# Altium schematic sheet 精简版V5_2021-10-22.schdoc
size 430 x 384 mm
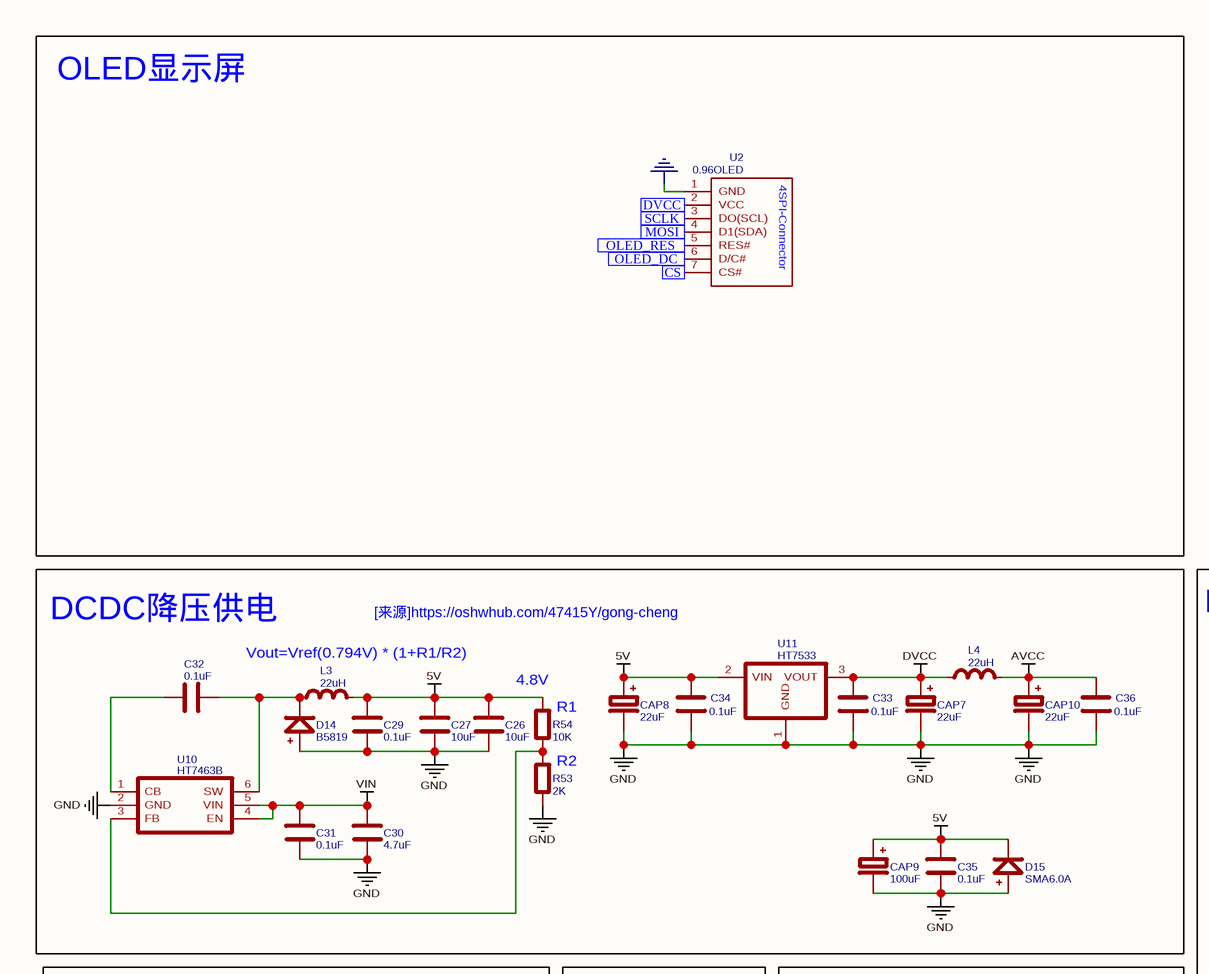
[diagram p0: 精简版V5_2021-10-22.schdoc, top left]
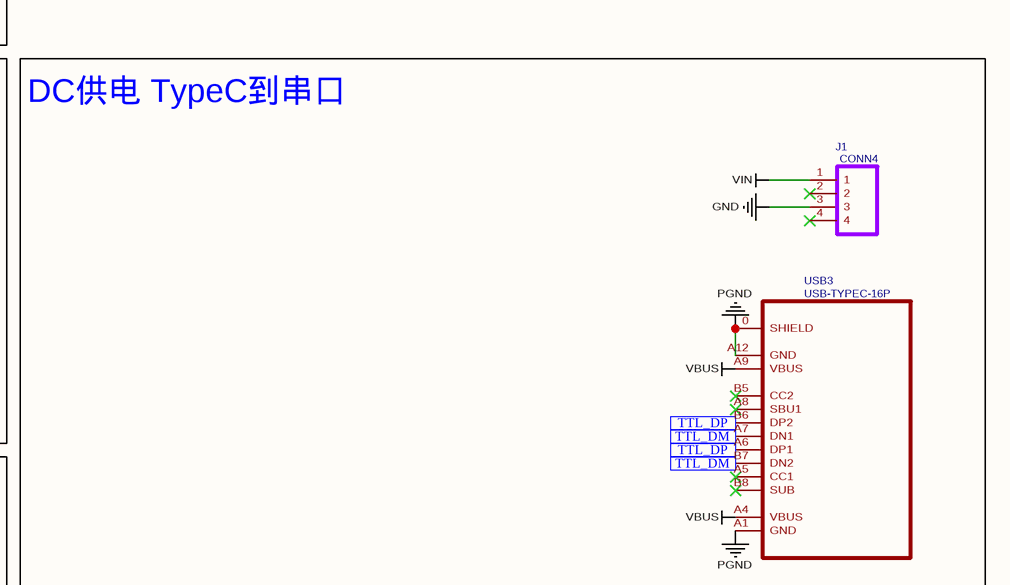
[diagram p1: 精简版V5_2021-10-22.schdoc, top right]
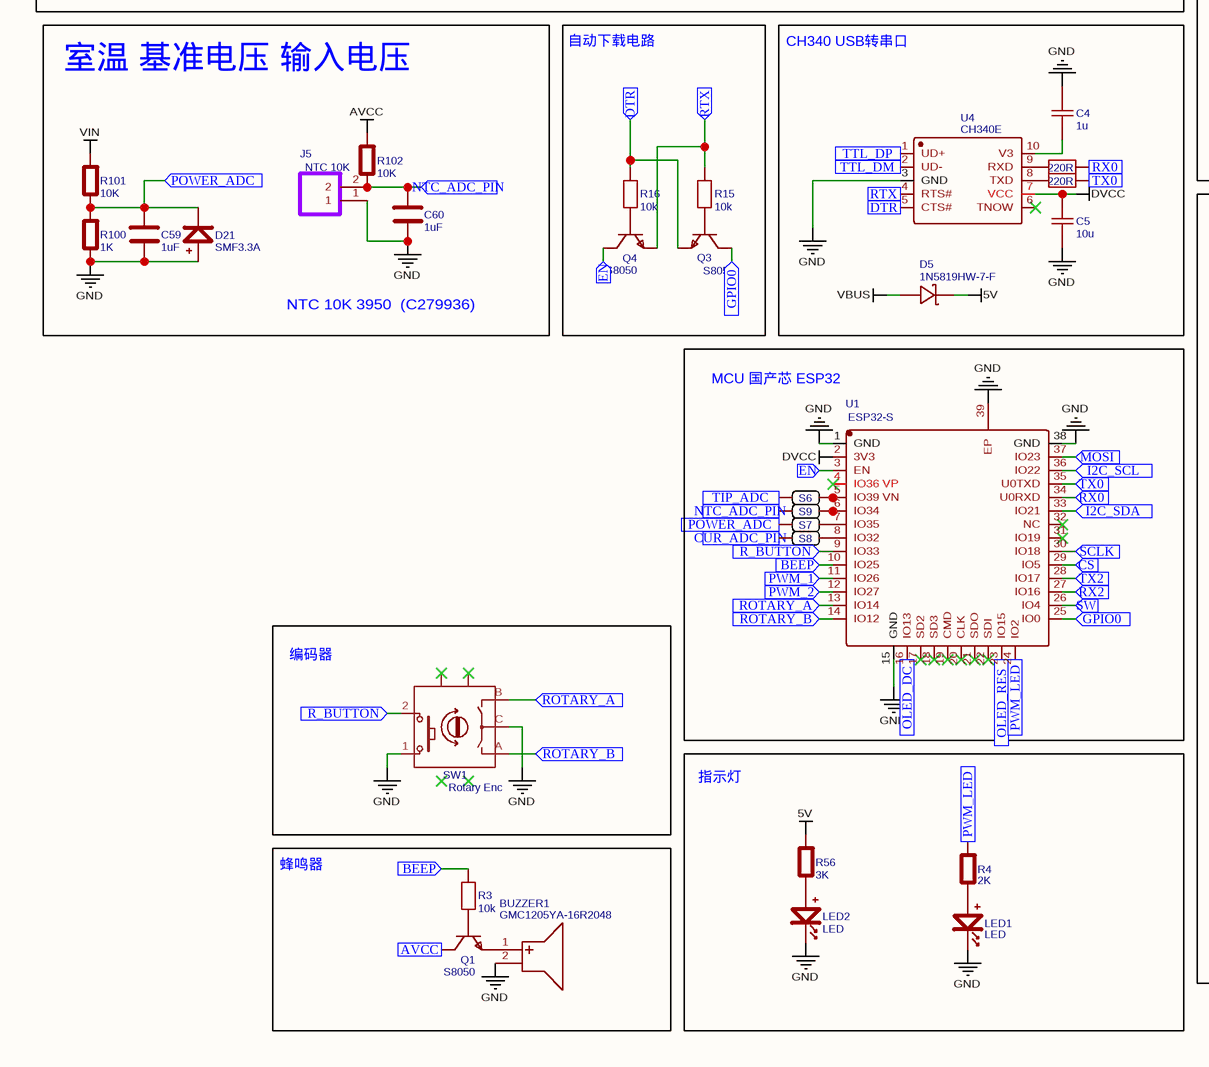
[diagram p2: 精简版V5_2021-10-22.schdoc, bottom left]
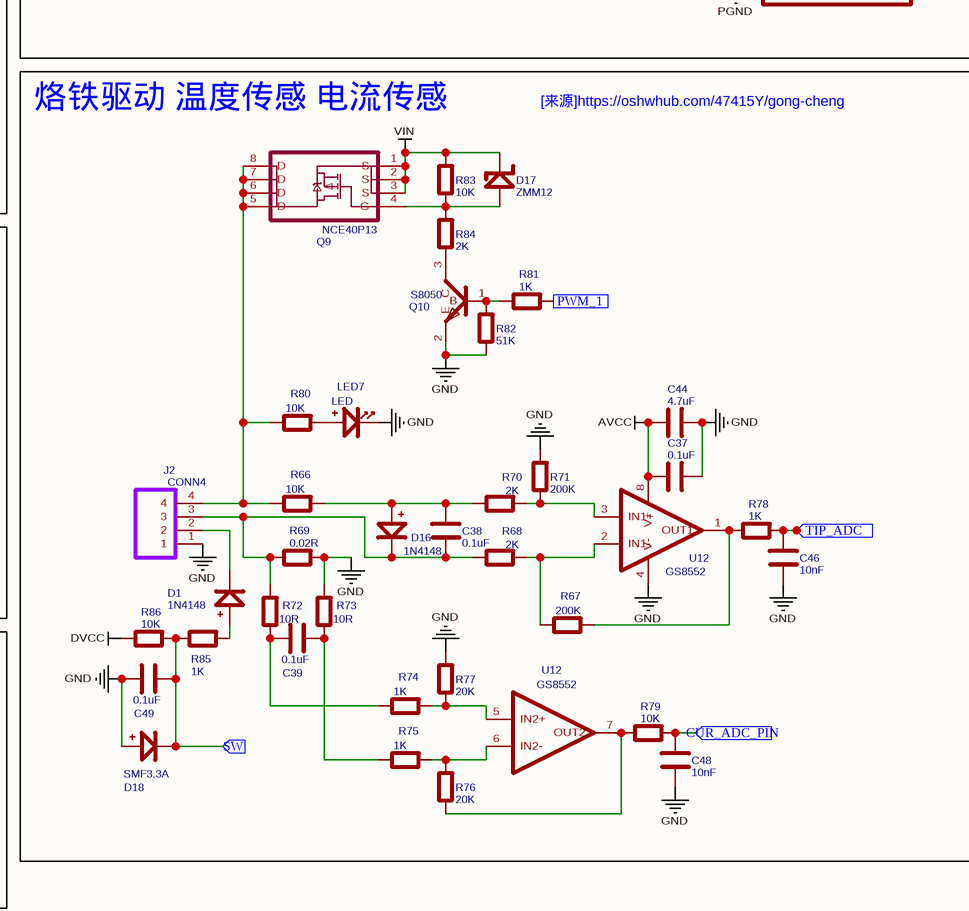
[diagram p3: 精简版V5_2021-10-22.schdoc, bottom right]

## Parts
(Parts that share a designator on the sheet are numbered #1, #2 ... from top to bottom, then left to right.)
BUZZER1  GMC1205YA-16R2048  [BUZ-TH_BD12.0-P6.50-D0.6-FD]
C4  1u  [C0603]
C5  10u  [C0603]
C26  10uF  [LC-0603-C]
C27  10uF  [LC-0603-C]
C29  0.1uF  [LC-0603-C]
C30  4.7uF  [LC-0603-C]
C31  0.1uF  [LC-0603-C]
C32  0.1uF  [LC-0603-C]
C33  0.1uF  [LC-0603-C]
C34  0.1uF  [LC-0603-C]
C35  0.1uF  [LC-0603-C]
C36  0.1uF  [LC-0603-C]
C37  0.1uF  [LC-0603-C]
C38  0.1uF  [LC-0603-C]
C39  0.1uF  [LC-0603-C]
C44  4.7uF  [LC-0603-C]
C46  10nF  [LC-0603-C]
C48  10nF  [LC-0603-C]
C49  0.1uF  [LC-0603-C]
C59  1uF  [LC-0603-C]
C60  1uF  [LC-0603-C]
CAP7  22uF  [CAPX-5.0]
CAP8  22uF  [CAPX-5.0]
CAP9  100uF  [CAPX-5.0]
CAP10  22uF  [CAPX-5.0]
D1  1N4148  [LC-SOD-123]
D5  1N5819HW-7-F  [SOD-123_L2.8-W1.8-LS3.7-FD]
D14  B5819  [LC-SOD-123]
D15  SMA6.0A  [LC-SOD-123]
D16  1N4148  [LC-SOD-123]
D17  ZMM12  [LC-SOD-123]
D18  SMF3.3A  [LC-SOD-123]
D21  SMF3.3A  [LC-SOD-123]
J1  CONN4  [SIP-4]
J2  CONN4  [SIP-4]
J5  NTC 10K  [SIP-2]
L3  22uH  [LIN0520]
L4  22uH  [LIN0520]
LED1  LED  [LC-0603-LED]
LED2  LED  [LC-0603-LED]
LED7  LED  [LC-0603-LED]
Q1  S8050  [SOT-23-3_L2.9-W1.3-P1.90-LS2.4-BR]
Q3  S8050  [SOT-23-3_L2.9-W1.3-P1.90-LS2.4-BR]
Q4  S8050  [SOT-23-3_L2.9-W1.3-P1.90-LS2.4-BR]
Q9  NCE40P13  [DFN8-5*6]
Q10  S8050  [LC-SOT-23(SOT-23-3)]
R3  10k  [R0603]
R4  2K  [LC-0603-R]
R15  10k  [R0603]
R16  10k  [R0603]
R18  220R  [R0603]
R19  220R  [R0603]
R53  2K  [LC-0603-R]
R54  10K  [LC-0603-R]
R56  3K  [LC-0603-R]
R66  10K  [LC-0603-R]
R67  200K  [LC-0603-R]
R68  2K  [LC-0603-R]
R69  0.02R  [LC-0603-R]
R70  2K  [LC-0603-R]
R71  200K  [LC-0603-R]
R72  10R  [LC-0603-R]
R73  10R  [LC-0603-R]
R74  1K  [LC-0603-R]
R75  1K  [LC-0603-R]
R76  20K  [LC-0603-R]
R77  20K  [LC-0603-R]
R78  1K  [LC-0603-R]
R79  10K  [LC-0603-R]
R80  10K  [LC-0603-R]
R81  1K  [LC-0603-R]
R82  51K  [LC-0603-R]
R83  10K  [LC-0603-R]
R84  2K  [LC-0603-R]
R85  1K  [LC-0603-R]
R86  10K  [LC-0603-R]
R100  1K  [LC-0603-R]
R101  10K  [LC-0603-R]
R102  10K  [LC-0603-R]
S6  Solder  [SW_HAND_WELD_JX]  (value not drawn)
S7  Solder  [SW_HAND_WELD_JX]  (value not drawn)
S8  Solder  [SW_HAND_WELD_JX]  (value not drawn)
S9  Solder  [SW_HAND_WELD_JX]  (value not drawn)
SW1  Rotary Enc  [SW-TH_PEC11R-4XXXF-SXXXX]
U1  ESP32-S  [WIRELM-SMD_ESP32-S]
U2  0.96OLED  [OLED 12864 SPI 7P]
U4  CH340E  [MSOP-10_L3.0-W3.0-P0.50-LS5.0-BL]
U10  HT7463B  [LC-SOT-23-6]
U11  HT7533  [LC-SOT-89]
U12#1  GS8552  [LC-SOP-8-150MIL]
U12#2  GS8552  [LC-SOP-8-150MIL]
USB3  USB-TYPEC-16P  [USB-TYPE-C-16P]

## Blocks framed on the sheet
OLED显示屏: U2
DCDC降压供电: C26 C27 C29-C36 CAP7-CAP10 D14 D15 L3 L4 R53 R54 U10 U11
DC供电 TypeC到串口: J1 USB3
室温 基准电压 输入电压: C59 C60 D21 J5 R100-R102
自动下载电路: Q3 Q4 R15 R16
CH340 USB转串口: C4 C5 D5 R18 R19 U4
烙铁驱动 温度传感 电流传感: C37-C39 C44 C46 C48 C49 D1 D16-D18 J2 LED7 Q9 Q10 R66-R86 U12#1 U12#2
MCU 国产芯 ESP32: S6-S9 U1
编码器: SW1
指示灯: LED1 LED2 R4 R56
蜂鸣器: BUZZER1 Q1 R3

## Ports
AVCC (in), BEEP (in), CS (in), CUR_ADC_PIN (in), DTR (in), DVCC (in), EN (in), GPIO0 (in), I2C_SCL (in), I2C_SDA (in), MOSI (in), NTC_ADC_PIN (in), OLED_DC (in), OLED_RES (in), POWER_ADC (in), PWM_1 (in), PWM_2 (in), PWM_LED (in), R_BUTTON (in), ROTARY_A (in), ROTARY_B (in), RTX (in), RX0 (in), RX2 (in), SCLK (in), SW (in), TIP_ADC (in), TTL_DM (in), TTL_DP (in), TX0 (in), TX2 (in)

## Nets
5V: C26.1 C27.1 C29.1 C34.2 C35.1 CAP8.1 CAP9.1 D5.2(K) D15.2 L3.2 R54.2 R56.2 U11.2(VIN)
AVCC: C36.2 C37.2 C44.2 CAP10.1 L4.2 R102.2 U12#1.8(V+)
DVCC: C5.2 C33.2 CAP7.1 L4.1 R86.1 U1.2(3V3) U4.7(VCC) U11.3(VOUT)
GND: BUZZER1.2(-) C4.2 C5.1 C26.2 C27.2 C29.2 C30.2 C31.2 C33.1 C34.1 C35.2 C36.1 C37.1 C44.1 C46.2 C48.2 C49.1 C59.2 C60.2 CAP7.2 CAP8.2 CAP9.2 CAP10.2 D14.1 D15.1 D18.1 D21.1 J1.3 J2.1 J5.1 LED1.K LED2.K LED7.K Q10.2(E) R53.1 R69.2 R71.2 R73.2 R77.2 R82.1 R100.1 SW1.1 SW1.C U1.1(GND) U1.15(GND) U1.38(GND) U1.39(EP) U2.1(GND) U4.3(GND) U10.2(GND) U11.1(GND) U12#1.4(V-)
PGND: USB3.0(SHIELD) USB3.A1(GND) USB3.A12(GND)
VBUS: D5.1(A) USB3.A4(VBUS) USB3.A9(VBUS)
VIN: C30.1 C31.1 D17.2 J1.1 Q9.1(S) Q9.2(S) Q9.3(S) R83.2 R101.2 U10.4(EN) U10.5(VIN)
AVCC: Q1.3(C) ; port AVCC  [a separate net that carries the same name]
BEEP: R3.2 U1.10(IO25) ; port BEEP
CS: U1.29(IO5) U2.7(CS#) ; port CS
CUR_ADC_PIN: C48.1 R79.1 S8.2 ; port CUR_ADC_PIN
DTR: Q3.2(E) R16.2 U4.5(CTS#) ; port DTR
DVCC: U2.2(VCC) ; port DVCC  [a separate net that carries the same name]
EN: Q4.3(C) U1.3(EN) ; port EN
GPIO0: Q3.3(C) U1.25(IO0) ; port GPIO0
I2C_SCL: U1.36(IO22) ; port I2C_SCL
I2C_SDA: U1.33(IO21) ; port I2C_SDA
MOSI: U1.37(IO23) U2.4(D1(SDA)) ; port MOSI
NTC_ADC_PIN: C60.1 J5.2 R102.1 S9.2 ; port NTC_ADC_PIN
OLED_DC: U1.16(IO13) U2.6(D/C#) ; port OLED_DC
OLED_RES: U1.23(IO15) U2.5(RES#) ; port OLED_RES
POWER_ADC: C59.1 D21.2 R100.2 R101.1 S7.2 ; port POWER_ADC
PWM_1: R81.1 U1.11(IO26) ; port PWM_1
PWM_2: U1.12(IO27) ; port PWM_2
PWM_LED: R4.2 U1.24(IO2) ; port PWM_LED
R_BUTTON: SW1.2 U1.9(IO33) ; port R_BUTTON
ROTARY_A: SW1.B U1.13(IO14) ; port ROTARY_A
ROTARY_B: SW1.A U1.14(IO12) ; port ROTARY_B
RTX: Q4.2(E) R15.2 U4.4(RTS#) ; port RTX
RX0: R18.2 U1.34(U0RXD) ; port RX0
RX2: U1.27(IO16) ; port RX2
SCLK: U1.30(IO18) U2.3(DO(SCL)) ; port SCLK
SW: C49.2 D18.2 R85.2 R86.2 U1.26(IO4) ; port SW
TIP_ADC: C46.1 R78.1 S6.2 ; port TIP_ADC
TTL_DM: U4.2(UD-) USB3.A7(DN1) USB3.B7(DN2) ; port TTL_DM
TTL_DP: U4.1(UD+) USB3.A6(DP1) USB3.B6(DP2) ; port TTL_DP
TX0: R19.2 U1.35(U0TXD) ; port TX0
TX2: U1.28(IO17) ; port TX2
NetBUZZER1_1: BUZZER1.1(+) Q1.2(E)
NetC4_1: C4.1 U4.10(V3)
NetC32_1: C32.1 D14.2 L3.1 U10.6(SW)
NetC32_2: C32.2 U10.1(CB)
NetC38_1: C38.1 D16.1 R66.2 R70.1
NetC38_2: C38.2 D16.2 J2.3 R68.2 R69.1 R72.2
NetC39_1: C39.1 R72.1 R74.1
NetC39_2: C39.2 R73.1 R75.1
NetD1_1: D1.1 R85.1
NetD1_2: D1.2 J2.2
NetD17_1: D17.1 Q9.4(G) R83.1 R84.2
NetJ2_4: J2.4 Q9.5(D) Q9.6(D) Q9.7(D) Q9.8(D) R66.1 R80.1
NetLED1_A: LED1.A R4.1
NetLED2_A: LED2.A R56.1
NetLED7_A: LED7.A R80.2
NetQ1_1: Q1.1(B) R3.1
NetQ3_1: Q3.1(B) R15.1
NetQ4_1: Q4.1(B) R16.1
NetQ10_1: Q10.1(B) R81.2 R82.2
NetQ10_3: Q10.3(C) R84.1
NetR18_1: R18.1 U4.9(RXD)
NetR19_1: R19.1 U4.8(TXD)
NetR53_2: R53.2 R54.1 U10.3(FB)
NetR67_1: R67.1 R68.1 U12#1.2(IN1-)
NetR67_2: R67.2 R78.2 U12#1.1(OUT1)
NetR70_2: R70.2 R71.1 U12#1.3(IN1+)
NetR74_2: R74.2 R77.1 U12#2.5(IN2+)
NetR75_2: R75.2 R76.2 U12#2.6(IN2-)
NetR76_1: R76.1 R79.2 U12#2.7(OUT2)
NetS6_1: S6.1 U1.5(IO39_VN)
NetS7_1: S7.1 U1.7(IO35)
NetS8_1: S8.1 U1.8(IO32)
NetS9_1: S9.1 U1.6(IO34)

Not connected (* = marked no-connect by the designer): J1 2* 4*; SW1 MT1* MT2*; U1 4(IO36_VP)* 17(SD2)* 18(SD3)* 19(CMD)* 20(CLK)* 21(SDO)* 22(SDI)* 31(IO19)* 32(NC)*; U4 6(TNOW)*; USB3 A5(CC1)* A8(SBU1)* B5(CC2)* B8(SUB)*

## Notes on the sheet
- [来源]https://oshwhub.com/47415Y/gong-cheng
- Vout=Vref(0.794V) * (1+R1/R2)
- (near R54) 4.8V
- R2
- (near R54) R1
- NTC 10K 3950  (C279936)
- (in symbol 0.96OLED) 4SPI-Connector

## Library data of the parts
BUZZER1 = GMC1205YA-16R2048: BOM_Manufacturer: INGHAi; Contributor: LCSC; BOM_Supplier: LCSC; BOM_Supplier Part: C252915; BOM_Manufacturer Part: GMC1205YA-16R2048; BOM_JLCPCB Part Class: Extended Part; spicePre: B; spiceSymbolName: GMC1205YA-16R2048
C4 = 1u: nameAlias: Value(F); Contributor: LCEDA_Lib; spicePre: C; spiceSymbolName: C_0603_US
C5 = 10u: nameAlias: Value(F); Contributor: LCEDA_Lib; spicePre: C; spiceSymbolName: C_0603_US
C26 C27 = 10uF: Contributor: 47415Y; spicePre: C; spiceSymbolName: CAP
C29 C31-C39 C49 = 0.1uF: Contributor: 47415Y; spicePre: C; spiceSymbolName: CAP
C30 C44 = 4.7uF: Contributor: 47415Y; spicePre: C; spiceSymbolName: CAP
C46 C48 = 10nF: Contributor: 47415Y; spicePre: C; spiceSymbolName: CAP
C59 C60 = 1uF: Contributor: 47415Y; spicePre: C; spiceSymbolName: CAP
CAP7 CAP8 CAP10 = 22uF: Contributor: 47415Y; spicePre: C; spiceSymbolName: CAPX
CAP9 = 100uF: Contributor: 47415Y; spicePre: C; spiceSymbolName: CAPX
D1 D16 = 1N4148: Contributor: 47415Y; spicePre: D; spiceSymbolName: DIO
D5 = 1N5819HW-7-F: BOM_Manufacturer: DIODES; BOM_Paste Type: expand; BOM_Assembly Type: smtWeld; BOM_Supplier: LCSC; BOM_Manufacturer Part: 1N5819HW-7-F; image: //image.lceda.cn/szlcsc/C82544.jpg; BOM_Supplier Part: C82544; spicePre: D; spiceSymbolName: 1N5819HW-7-F; BOM_JLCPCB Part Class: Extended Part
D14 = B5819: Contributor: 47415Y; spicePre: D; spiceSymbolName: DIO
D15 = SMA6.0A: Contributor: 47415Y; spicePre: D; spiceSymbolName: DIO
D17 = ZMM12: Contributor: 47415Y; spicePre: D; spiceSymbolName: ZER
D18 D21 = SMF3.3A: Contributor: 47415Y; spicePre: D; spiceSymbolName: DIO
J1 J2 = CONN4: Contributor: 47415Y; spicePre: J; spiceSymbolName: CONN4
J5 = NTC 10K: Contributor: 47415Y; spicePre: J; spiceSymbolName: CONN2
L3 L4 = 22uH: Contributor: 47415Y; spicePre: L; spiceSymbolName: LIN
LED1 LED2 LED7 = LED: Contributor: 47415Y; spicePre: L; spiceSymbolName: LED
Q1 Q3 Q4 = S8050: BOM_Manufacturer: WPMtek(维攀微); Contributor: LCSC; BOM_Supplier: LCSC; BOM_Supplier Part: C2688231; BOM_Manufacturer Part: S8050; spicePre: Q; spiceSymbolName: S8050; BOM_JLCPCB Part Class: Extended Part
Q9 = NCE40P13: Contributor: 47415Y; spicePre: Q; spiceSymbolName: MOS-P-DFN
Q10 = S8050: Contributor: 47415Y; spicePre: Q; spiceSymbolName: NPN
R3 R15 R16 = 10k: nameAlias: Value(Ω); Contributor: LCEDA_Lib; spicePre: R; spiceSymbolName: R_0603_EU
R4 R53 R68 R70 R84 = 2K: Contributor: 47415Y; spicePre: R; spiceSymbolName: RES
R18 R19 = 220R: nameAlias: Value(Ω); Contributor: LCEDA_Lib; spicePre: R; spiceSymbolName: R_0603_EU
R54 R66 R79 R80 R83 R86 R101 R102 = 10K: Contributor: 47415Y; spicePre: R; spiceSymbolName: RES
R56 = 3K: Contributor: 47415Y; spicePre: R; spiceSymbolName: RES
R67 R71 = 200K: Contributor: 47415Y; spicePre: R; spiceSymbolName: RES
R69 = 0.02R: Contributor: 47415Y; spicePre: R; spiceSymbolName: RES
R72 R73 = 10R: Contributor: 47415Y; spicePre: R; spiceSymbolName: RES
R74 R75 R78 R81 R85 R100 = 1K: Contributor: 47415Y; spicePre: R; spiceSymbolName: RES
R76 R77 = 20K: Contributor: 47415Y; spicePre: R; spiceSymbolName: RES
R82 = 51K: Contributor: 47415Y; spicePre: R; spiceSymbolName: RES
S6-S9 = Solder: BOM_Mounted: No; spicePre: S
SW1 = Rotary Enc: BOM_Manufacturer: BOURNS; BOM_Manufacturer Part: PEC11R-4015F-S0024; Contributor: LCSC; BOM_Supplier: LCSC; BOM_Supplier Part: C143789; spicePre: S; BOM_JLCPCB Part Class: Extended Part; spiceSymbolName: PEC11R-4015F-S0024
U1 = ESP32-S: BOM_Manufacturer: Ai-Thinker; Contributor: LCSC; Package Display: No; BOM_Supplier: LCSC; BOM_Supplier Part: C277944; BOM_Manufacturer Part: ESP32-S; BOM_JLCPCB Part Class: Extended Part; spicePre: U; spiceSymbolName: ESP32-S
U2 = 0.96OLED: Contributor: jhsdhdhusdisd; spicePre: U; spiceSymbolName: 0.96OLED
U4 = CH340E: BOM_Manufacturer: WCH; BOM_Paste Type: recommend; BOM_Supplier: LCSC; BOM_Manufacturer Part: CH340E; BOM_Supplier Part: C99652; spicePre: U; spiceSymbolName: CH340E; BOM_JLCPCB Part Class: Extended Part
U10 = HT7463B: Contributor: 47415Y; spicePre: U; spiceSymbolName: HT7463B
U11 = HT7533: Contributor: 47415Y; spicePre: U; spiceSymbolName: HT7533
U12#1 = GS8552: subpart_no: 1; Contributor: 47415Y; spicePre: U; spiceSymbolName: LM358
U12#2 = GS8552: subpart_no: 2; Contributor: 47415Y; spicePre: U; spiceSymbolName: LM358
USB3 = USB-TYPEC-16P: Contributor: 47415Y; spicePre: U; spiceSymbolName: USB-TYPEC-16P